# Altium schematic sheet AD8318.SchDoc
size A4
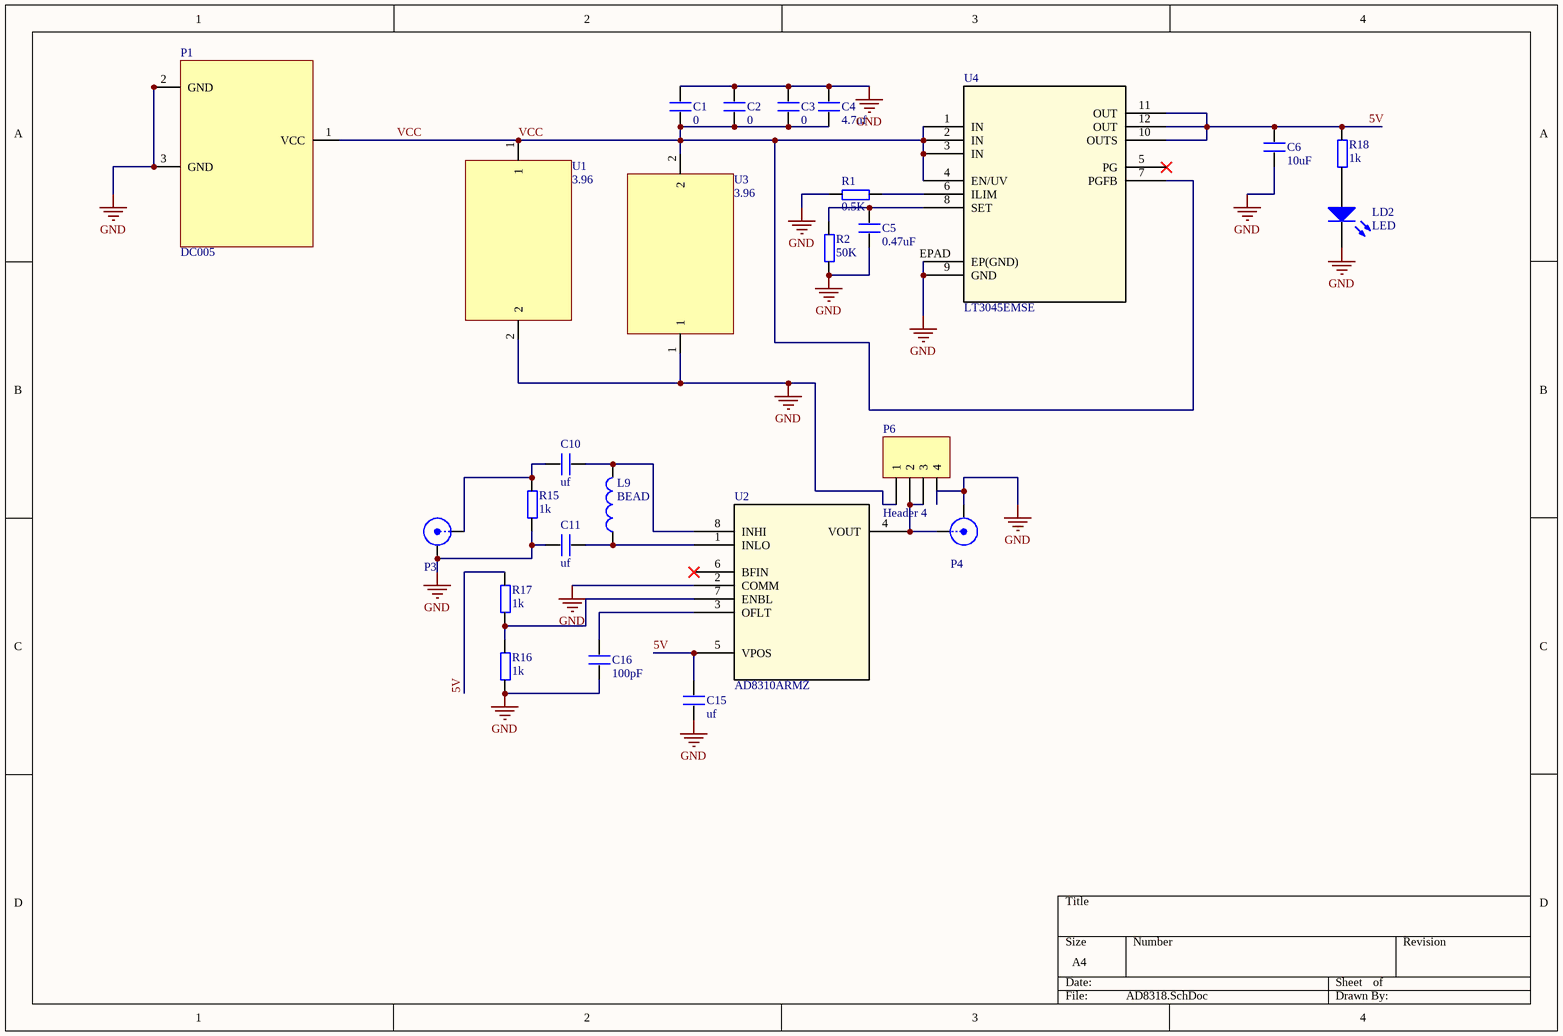
[diagram p0: AD8318.SchDoc]

## Parts
C1  0  [CAP 1.5*4*8]
C2  0  [CAP 1.5*4*8]
C3  0  [0603C]
C4  4.7uf  [0603C]
C5  0.47uF  [0402]
C6  10uF  [0402]
C10  uf  [0603C]
C11  uf  [0603C]
C15  uf  [0603C]
C16  100pF  [0603C]
L9  BEAD  [0603L]
LD2  LED  [SMDLED]
P1  DC005  [DC10B]
P3  SMA  [SMA]  (value not drawn)
P4  SMA  [SMA]  (value not drawn)
P6  Header 4  [HDR1X4]
R1  0.5K  [0402]
R2  50K  [0402]
R15  1k  [0603R]
R16  1k  [0402]
R17  1k  [0402]
R18  1k  [0603R]
U1  3.96  [3.96]
U2  AD8310ARMZ  [RM_8_ADI]
U3  3.96  [3.96]
U4  LT3045EMSE  [MSOP12-MSE-RevG_ADI]

## Nets
GND: C1.2 C2.2 C3.2 C4.2 C5.2 C6.1 C11.1 C15.1 C16.1 LD2.2(K) P1.2(GND) P1.3(GND) P3.2(Y) P4.2(Y) P6.1 P6.4 R1.1 R2.1 R15.1 R16.1 U1.2 U2.2(COMM) U3.1 U4.9(GND) U4.EPAD(EP(GND))
5V: C6.2 C15.2 R17.2 R18.2 U2.5(VPOS) U4.10(OUTS) U4.11(OUT) U4.12(OUT)
VCC: C1.1 C2.1 C3.1 C4.1 P1.1(VCC) U1.1 U3.2 U4.1(IN) U4.2(IN) U4.3(IN) U4.4(EN/UV) U4.7(PGFB)
NetC5_1: C5.1 R2.2 U4.8(SET)
NetC10_1: C10.1 P3.1(X) R15.2
NetC10_2: C10.2 L9.2 U2.8(INHI)
NetC11_2: C11.2 L9.1 U2.1(INLO)
NetC16_2: C16.2 U2.3(OFLT)
NetLD2_1: LD2.1(A) R18.1
NetP4_1: P4.1(X) P6.2 P6.3 U2.4(VOUT)
NetR1_2: R1.2 U4.6(ILIM)
NetR16_2: R16.2 R17.1 U2.7(ENBL)

Not connected (* = marked no-connect by the designer): U2 6(BFIN)*; U4 5(PG)*

## Notes on the sheet
- Labels drawn without touching a wire or pin: 5V

## Library data of the parts
C1-C6 C10 C11 C15 C16 = C: Capacitor
L9 = Inductor: Value: 100uH; Published: 8-Jun-2000; Revision: July-2002: Re-released for DXP Platform.; Publisher: Altium Limited
LD2 = LED: Typical RED, GREEN, YELLOW, AMBER GaAs LED; Published: 8-Jun-2000; LatestRevisionDate: 17-Jul-2002; LatestRevisionNote: Re-released for DXP Platform.; PackageDocument: Feb-2002; PackageReference: 3.2X1.6X1.1; Publisher: Altium Limited
P3 P4 = SMA: SMA Connector
P6 = Header 4: Header, 4-Pin; LatestRevisionDate: 17-Jul-2002; LatestRevisionNote: Re-released for DXP Platform.; Publisher: Altium Limited
R1 R2 R15-R18 = Resistor
U2 = AD8310ARMZ: No Description Available; SourceLibrary: Analog_2012-01-01_5; Built_By: EMA_UL_Team; Vendor: Analog Devices Inc; Manufacturer_Part_Number: AD8310ARMZ; Copyright: Copyright (C) 2018 Accelerated Designs. All rights reserved; RefDes: RefDes; Type: DEV
U4 = LT3045EMSE: No Description Available; SourceLibrary: Analog_Devices_Inc_2020-09-15; Built_By: SunStream; Vendor: Analog Devices Inc; Copyright: Copyright (C) 2018 Accelerated Designs. All rights reserved; Manufacturer_Part_Number: LT3045EMSE; RefDes: RefDes; Type: DEV